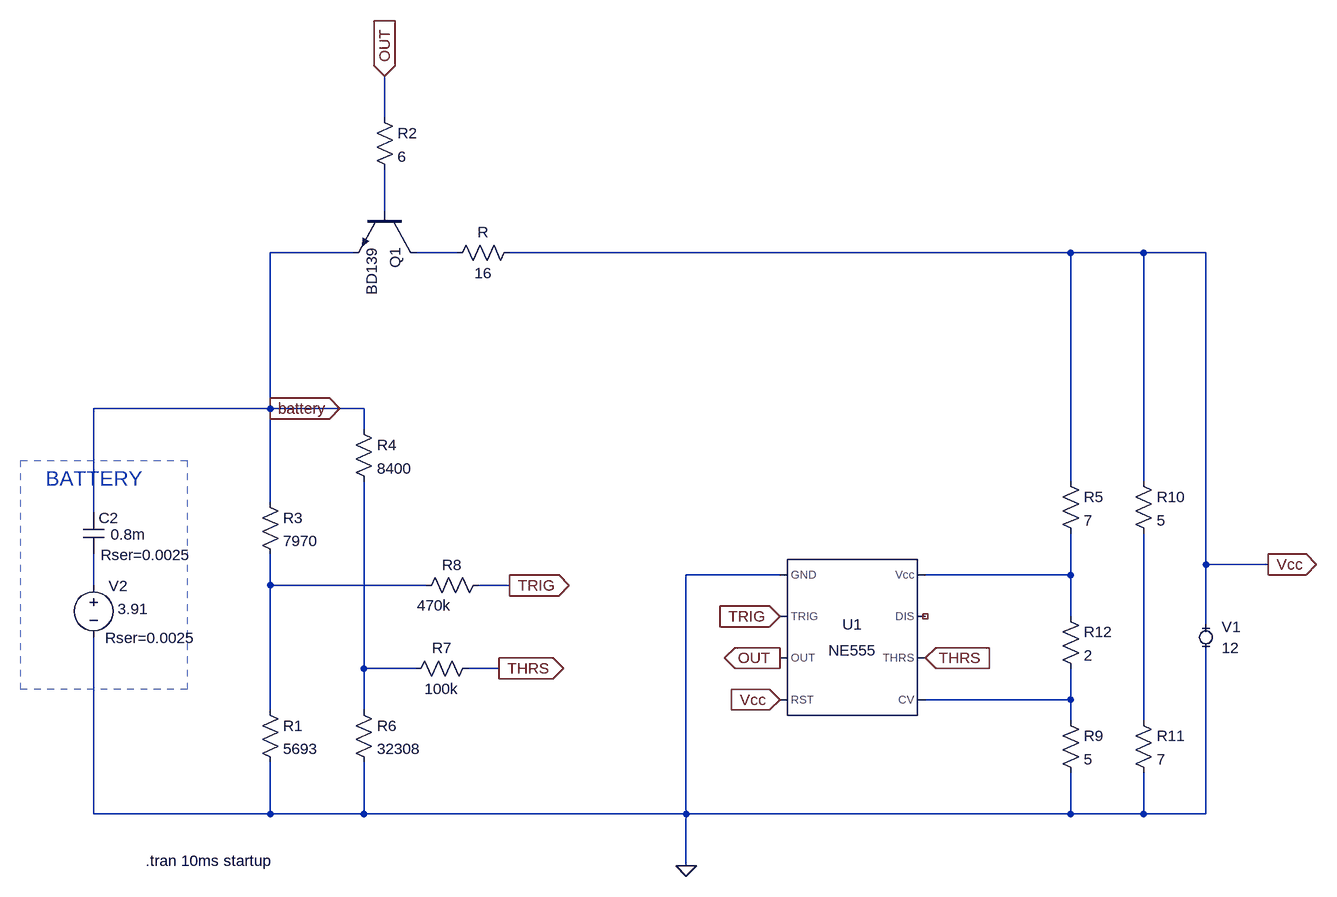
[diagram p0: schematic PRACTICE.asc]
PRACTICE.asc, the LTspice schematic file:
Version 4
SHEET 1 1952 1524
WIRE -224 -368 -224 -432
WIRE -224 -224 -224 -288
WIRE -272 -160 -400 -160
WIRE -112 -160 -176 -160
WIRE 832 -160 -32 -160
WIRE 944 -160 832 -160
WIRE 1040 -160 944 -160
WIRE -400 80 -400 -160
WIRE -400 80 -672 80
WIRE -256 80 -400 80
WIRE -256 112 -256 80
WIRE 832 192 832 -160
WIRE 944 192 944 -160
WIRE -400 224 -400 80
WIRE -672 240 -672 80
WIRE 1040 320 1040 -160
WIRE 1136 320 1040 320
WIRE 384 336 240 336
WIRE 832 336 832 272
WIRE 832 336 608 336
WIRE -672 352 -672 304
WIRE -400 352 -400 304
WIRE -160 352 -400 352
WIRE -32 352 -80 352
WIRE 832 400 832 336
WIRE 1040 416 1040 320
WIRE -256 480 -256 192
WIRE -176 480 -256 480
WIRE -48 480 -96 480
WIRE 832 528 832 480
WIRE 832 528 608 528
WIRE -400 544 -400 352
WIRE -256 544 -256 480
WIRE 832 560 832 528
WIRE 944 560 944 272
WIRE -672 704 -672 432
WIRE -400 704 -400 624
WIRE -400 704 -672 704
WIRE -256 704 -256 624
WIRE -256 704 -400 704
WIRE 240 704 240 336
WIRE 240 704 -256 704
WIRE 832 704 832 640
WIRE 832 704 240 704
WIRE 944 704 944 640
WIRE 944 704 832 704
WIRE 1040 704 1040 448
WIRE 1040 704 944 704
WIRE 240 784 240 704
FLAG 384 464 OUT
IOPIN 384 464 Out
FLAG 608 464 THRS
IOPIN 608 464 In
FLAG -48 480 THRS
IOPIN -48 480 Out
FLAG -32 352 TRIG
IOPIN -32 352 Out
FLAG 384 400 TRIG
IOPIN 384 400 In
FLAG 240 784 0
FLAG -224 -432 OUT
IOPIN -224 -432 In
FLAG 1136 320 Vcc
IOPIN 1136 320 Out
FLAG 384 528 Vcc
IOPIN 384 528 In
FLAG -400 80 battery
IOPIN -400 80 Out
SYMBOL res -416 208 R0
SYMATTR InstName R3
SYMATTR Value 7970
SYMBOL res -128 -144 R270
WINDOW 0 32 56 VTop 2
WINDOW 3 0 56 VBottom 2
SYMATTR InstName R
SYMATTR Value 16
SYMATTR SpiceLine pwr=15
SYMBOL res -272 528 R0
SYMATTR InstName R6
SYMATTR Value 32308
SYMBOL res -80 464 R90
WINDOW 0 0 56 VBottom 2
WINDOW 3 32 56 VTop 2
SYMATTR InstName R7
SYMATTR Value 100k
SYMBOL res -64 336 R90
WINDOW 0 0 56 VBottom 2
WINDOW 3 31 84 VTop 2
SYMATTR InstName R8
SYMATTR Value 470k
SYMBOL Misc\\NE555 496 432 R0
SYMATTR InstName U1
SYMBOL voltage -672 336 R0
WINDOW 3 37 52 Left 2
WINDOW 123 24 138 Left 2
WINDOW 39 18 97 Left 2
WINDOW 0 23 17 Left 2
SYMATTR Value 3.91
SYMATTR SpiceLine Rser=0.0025
SYMATTR InstName V2
SYMBOL cap -688 240 R0
WINDOW 3 42 34 Left 2
WINDOW 39 27 65 Left 2
WINDOW 40 24 98 Left 2
SYMATTR Value 0.8m
SYMATTR SpiceLine Rser=0.0025
SYMATTR InstName C2
SYMBOL npn -176 -224 R90
SYMATTR InstName Q1
SYMATTR Value BD139
SYMBOL res -240 -384 R0
SYMATTR InstName R2
SYMATTR Value 6
SYMBOL res -416 528 R0
SYMATTR InstName R1
SYMATTR Value 5693
SYMBOL res -272 96 R0
SYMATTR InstName R4
SYMATTR Value 8400
SYMBOL MiniSyms4\\voltage- 1040 432 R0
WINDOW 123 0 0 Left 2
WINDOW 39 0 0 Left 2
SYMATTR InstName V1
SYMATTR Value 12
SYMBOL res 816 176 R0
SYMATTR InstName R5
SYMATTR Value 7
SYMBOL res 816 544 R0
SYMATTR InstName R9
SYMATTR Value 5
SYMBOL res 928 176 R0
SYMATTR InstName R10
SYMATTR Value 5
SYMBOL res 928 544 R0
SYMATTR InstName R11
SYMATTR Value 7
SYMBOL res 816 384 R0
SYMATTR InstName R12
SYMATTR Value 2
TEXT -592 776 Left 2 !.tran 10ms startup
TEXT -672 208 Bottom 3 ;BATTERY
RECTANGLE Normal -528 512 -784 160 2

The netlist it stands for:
* PRACTICE.asc
R3 battery N005 7970
R N002 Vcc 16 pwr=15
R6 N006 0 32308
R7 THRS N006 100k
R8 TRIG N005 470k
XU1 0 TRIG OUT Vcc N007 THRS NC_01 N003 NE555  ; pins GND TRIG OUT RST CV THRS DIS Vcc
V2 N004 0 3.91 Rser=0.0025
C2 battery N004 0.8m Rser=0.0025
Q1 N002 N001 battery 0 BD139
R2 OUT N001 6
R1 N005 0 5693
R4 battery N006 8400
V1 Vcc 0 12
R5 Vcc N003 7
R9 N007 0 5
R10 Vcc N008 5
R11 N008 0 7
R12 N003 N007 2
.model NPN NPN
.model PNP PNP
.lib standard.bjt
.tran 10ms startup
* BATTERY
.lib NE555.sub
.backanno
.end